# Altium schematic sheet DecentralizeLV_LPDRV.SchDoc
size A; SheetNumber: 1; SheetTotal: 1
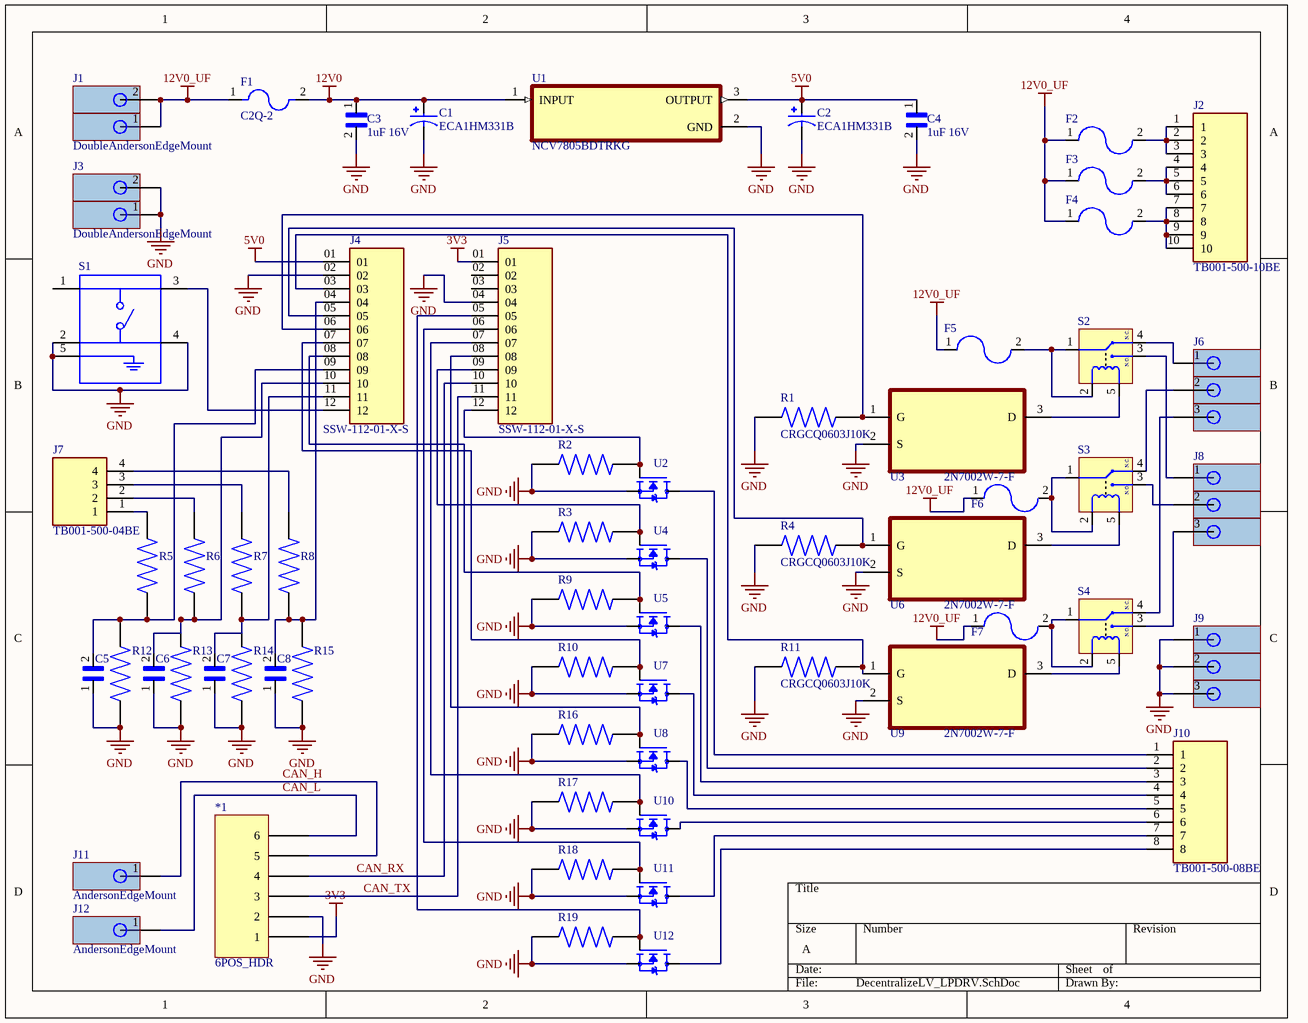
[diagram p0: DecentralizeLV_LPDRV.SchDoc]

## Parts
*1  6POS_HDR  [6POS_HDR]
C1  ECA1HM331B  [CAPPRD500W60D1000H1600]
C2  ECA1HM331B  [CAPPRD500W60D1000H1600]
C3  1uF 16V  [CAPC2012X135N]
C4  1uF 16V  [CAPC2012X135N]
C5  CL10B104KA8NNNC  [CAPC1608X90N]  (value not drawn)
C6  CL10B104KA8NNNC  [CAPC1608X90N]  (value not drawn)
C7  CL10B104KA8NNNC  [CAPC1608X90N]  (value not drawn)
C8  CL10B104KA8NNNC  [CAPC1608X90N]  (value not drawn)
F1  C2Q-2  [FUSC1608X56N]
F2  MiniAutomotiveFuseHolder  [MiniBladeFuseHolder]  (value not drawn)
F3  MiniAutomotiveFuseHolder  [MiniBladeFuseHolder]  (value not drawn)
F4  MiniAutomotiveFuseHolder  [MiniBladeFuseHolder]  (value not drawn)
F5  MiniAutomotiveFuseHolder  [MiniBladeFuseHolder]  (value not drawn)
F6  MiniAutomotiveFuseHolder  [MiniBladeFuseHolder]  (value not drawn)
F7  MiniAutomotiveFuseHolder  [MiniBladeFuseHolder]  (value not drawn)
J1  DoubleAndersonEdgeMount  [DoubleAndersonEdgeMount]
J2  TB001-500-10BE  [CUI_TB001-500-10BE]
J3  DoubleAndersonEdgeMount  [DoubleAndersonEdgeMount]
J4  SSW-112-01-X-S  [SAMTEC_SSW-112-01-X-S]
J5  SSW-112-01-X-S  [SAMTEC_SSW-112-01-X-S]
J6  TripleAndersonEdgeMount  [TripleAndersonEdgeMount - duplicate]  (value not drawn)
J7  TB001-500-04BE  [CUI_TB001-500-04BE]
J8  TripleAndersonEdgeMount  [TripleAndersonEdgeMount - duplicate]  (value not drawn)
J9  TripleAndersonEdgeMount  [TripleAndersonEdgeMount - duplicate]  (value not drawn)
J10  TB001-500-08BE  [CUI_TB001-500-08BE]
J11  AndersonEdgeMount  [AndersonEdgeMount]
J12  AndersonEdgeMount  [AndersonEdgeMount]
R1  CRGCQ0603J10K  [RESC1608X55N]
R2  CRGCQ0603J10K  [RESC1608X55N]  (value not drawn)
R3  CRGCQ0603J10K  [RESC1608X55N]  (value not drawn)
R4  CRGCQ0603J10K  [RESC1608X55N]
R5  CRGCQ0603J10K  [RESC1608X55N]  (value not drawn)
R6  CRGCQ0603J10K  [RESC1608X55N]  (value not drawn)
R7  CRGCQ0603J10K  [RESC1608X55N]  (value not drawn)
R8  CRGCQ0603J10K  [RESC1608X55N]  (value not drawn)
R9  CRGCQ0603J10K  [RESC1608X55N]  (value not drawn)
R10  CRGCQ0603J10K  [RESC1608X55N]  (value not drawn)
R11  CRGCQ0603J10K  [RESC1608X55N]
R12  RMCF0603JT2K00  [RESC1508X55N]  (value not drawn)
R13  RMCF0603JT2K00  [RESC1508X55N]  (value not drawn)
R14  RMCF0603JT2K00  [RESC1508X55N]  (value not drawn)
R15  RMCF0603JT2K00  [RESC1508X55N]  (value not drawn)
R16  CRGCQ0603J10K  [RESC1608X55N]  (value not drawn)
R17  CRGCQ0603J10K  [RESC1608X55N]  (value not drawn)
R18  CRGCQ0603J10K  [RESC1608X55N]  (value not drawn)
R19  CRGCQ0603J10K  [RESC1608X55N]  (value not drawn)
S1  TS06-667-43-BK-260-G-SMT-TR  [SW_TS06-667-43-BK-260-G-SMT-TR]  (value not drawn)
S2  SPDT 12V Relay 16A  [G5LE-1-E DC12]  (value not drawn)
S3  SPDT 12V Relay 16A  [G5LE-1-E DC12]  (value not drawn)
S4  SPDT 12V Relay 16A  [G5LE-1-E DC12]  (value not drawn)
U1  NCV7805BDTRKG  [DPAK229P990X238-4N]
U2  MOSFET N-CH  [ZXMN6A09GTA]  (value not drawn)
U3  2N7002W-7-F  [SOT65P210X110-3N]
U4  MOSFET N-CH  [ZXMN6A09GTA]  (value not drawn)
U5  MOSFET N-CH  [ZXMN6A09GTA]  (value not drawn)
U6  2N7002W-7-F  [SOT65P210X110-3N]
U7  MOSFET N-CH  [ZXMN6A09GTA]  (value not drawn)
U8  MOSFET N-CH  [ZXMN6A09GTA]  (value not drawn)
U9  2N7002W-7-F  [SOT65P210X110-3N]
U10  MOSFET N-CH  [ZXMN6A09GTA]  (value not drawn)
U11  MOSFET N-CH  [ZXMN6A09GTA]  (value not drawn)
U12  MOSFET N-CH  [ZXMN6A09GTA]  (value not drawn)

## Nets
3V3: *1.1 J5.01
5V0: C2.P C4.1 J4.01 U1.3(OUTPUT)
12V0: C1.P C3.1 F1.2 U1.1(INPUT)
12V0_UF: F1.1 F2.1 F3.1 F4.1 F5.1 F6.1 F7.1 J1.1 J1.2
GND: *1.2 C1.N C2.N C3.2 C4.2 C5.1 C6.1 C7.1 C8.1 J3.1 J3.2 J4.02 J5.04 J9.1 J9.2 J9.3 R1.2 R2.2 R3.2 R4.2 R9.2 R10.2 R11.2 R12.1 R13.1 R14.1 R15.1 R16.2 R17.2 R18.2 R19.2 S1.2 S1.4 S1.5 U1.2(GND) U2.3 U3.2(S) U4.3 U5.3 U6.2(S) U7.3 U8.3 U9.2(S) U10.3 U11.3 U12.3
CAN_H: *1.5 J11.1
CAN_L: *1.6 J12.1
CAN_RX: *1.4 J5.10
CAN_TX: *1.3 J5.11
NetC5_2: C5.2 J4.09 R5.2 R12.2
NetC6_2: C6.2 J4.10 R6.2 R13.2
NetC7_2: C7.2 J4.11 R7.2 R14.2
NetC8_2: C8.2 J4.04 R8.2 R15.2
NetF2_2: F2.2 J2.1 J2.2 J2.3
NetF3_2: F3.2 J2.4 J2.5 J2.6
NetF4_2: F4.2 J2.7 J2.8 J2.9 J2.10
NetF5_2: F5.2 S2.1 S2.2
NetF6_2: F6.2 S3.1 S3.2
NetF7_2: F7.2 S4.1 S4.2
NetJ4_03: J4.03 R11.1 U9.1(G)
NetJ4_05: J4.05 R4.1 U6.1(G)
NetJ4_06: J4.06 R1.1 U3.1(G)
NetJ4_07: J4.07 R10.1 U7.1
NetJ4_08: J4.08 R9.1 U5.1
NetJ4_12: J4.12 S1.3
NetJ5_05: J5.05 R19.1 U12.1
NetJ5_06: J5.06 R18.1 U11.1
NetJ5_07: J5.07 R17.1 U10.1
NetJ5_08: J5.08 R16.1 U8.1
NetJ5_09: J5.09 R3.1 U4.1
NetJ5_12: J5.12 R2.1 U2.1
NetJ6_1: J6.1 S2.4
NetJ6_2: J6.2 S3.4
NetJ6_3: J6.3 S4.4
NetJ7_1: J7.1 R5.1
NetJ7_2: J7.2 R6.1
NetJ7_3: J7.3 R7.1
NetJ7_4: J7.4 R8.1
NetJ8_1: J8.1 S2.3
NetJ8_2: J8.2 S3.3
NetJ8_3: J8.3 S4.3
NetJ10_1: J10.1 U2.2
NetJ10_2: J10.2 U4.2
NetJ10_3: J10.3 U5.2
NetJ10_4: J10.4 U7.2
NetJ10_5: J10.5 U8.2
NetJ10_6: J10.6 U10.2
NetJ10_7: J10.7 U11.2
NetJ10_8: J10.8 U12.2
NetS2_5: S2.5 U3.3(D)
NetS3_5: S3.5 U6.3(D)
NetS4_5: S4.5 U9.3(D)

Not connected (* = marked no-connect by the designer): J5 02 03; S1 1

## Notes on the sheet
- (in symbol G5LE-1-E DC12) N.C.; N.O.

## Library data of the parts
C1 C2 = ECA1HM331B: M-A; MF: {'manufacturer': u'Panasonic Electronic'}; MP: ECA1HM331B; Price: None; Package: None; Value: *; Availability: Unavailable
C3 C4 = CL21B105KOFNNNE: Cap Ceramic 1uF 16V X7R 10% Pad SMD 0805 125C T/R; MF: {'manufacturer': u'Samsung Electro-Mechanics'}; Price: None; MP: CL21B105KOFNNNE; Availability: Unavailable; Value: *; Package: None
C5-C8 = CL10B104KA8NNNC: MF: {'manufacturer': u'Samsung Electro-Mechanics'}; Package: None; Availability: Unavailable; Price: None; MP: CL10B104KA8NNNC; Value: *
F1 = C2Q-2: MF: {'manufacturer': u'Bel Fuse'}; Package: None; Availability: Unavailable; Value: *; MP: C2Q-2; Price: None
F2-F7 = MiniBladeFuseHolder: Blade Fuse Holder Automotive Mini
J1 J3 = DoubleAndersonEdgeMount: Edge Mounted Anderson Connector
J2 = TB001-500-10BE: MF: {'manufacturer': u'CUI Devices'}; MP: TB001-500-10BE; Price: None; Package: None; Value: *; Availability: Unavailable
J4 J5 = SSW-112-01-X-S: CONN RCPT 12POS 0.1 GOLD PCB; MF: {'manufacturer': u'Samtec'}; Package: None; Availability: Unavailable; Value: *; MP: SSW-112-01-X-S; Price: None
J6 J8 J9 = TripleAndersonEdgeMount: Edge Mounted Anderson Connector
J7 = TB001-500-04BE: MF: {'manufacturer': u'CUI Devices'}; Package: None; Availability: Unavailable; Price: None; MP: TB001-500-04BE; Value: *
J10 = TB001-500-08BE: MF: {'manufacturer': u'CUI Devices'}; MP: TB001-500-08BE; Package: None; Price: None; Availability: Unavailable; Value: *
J11 J12 = AndersonEdgeMount: Edge Mounted Anderson Connector
R1-R11 R16-R19 = CRGCQ0603J10K: Fixed Resistor CRGCQ 0603 10K 5%; MF: {'manufacturer': u'TE Connectivity'}; Package: None; Value: *; Availability: Unavailable; Price: None; MP: CRGCQ0603J10K
R12-R15 = RMCF0603JT2K00: MF: {'manufacturer': u'Stackpole Electronics Inc'}; Package: None; Availability: Unavailable; Price: None; MP: RMCF0603JT2K00; Value: *
S1 = TS06-667-43-BK-260-G-SMT-TR: MF: {'manufacturer': u'CUI Devices'}; MP: TS06-667-43-BK-260-G-SMT-TR; Price: None; Package: None; Value: *; Availability: Unavailable
S2-S4 = G5LE-1-E DC12
U1 = NCV7805BDTRKG: MF: {'manufacturer': u'ON Semiconductor'}; MP: NCV7805BDTRKG; Price: None; Package: None; Value: *; Availability: Unavailable
U2 U4 U5 U7 U8 U10-U12 = ZXMN6A09GTA
U3 U6 U9 = 2N7002W-7-F: N-CHANNEL ENHANCEMENT MODE FIELD EFFECT TRANSISTOR; MF: {'manufacturer': u'Diodes Zetex'}; Package: None; Value: *; Availability: Unavailable; Price: None; MP: 2N7002W-7-F